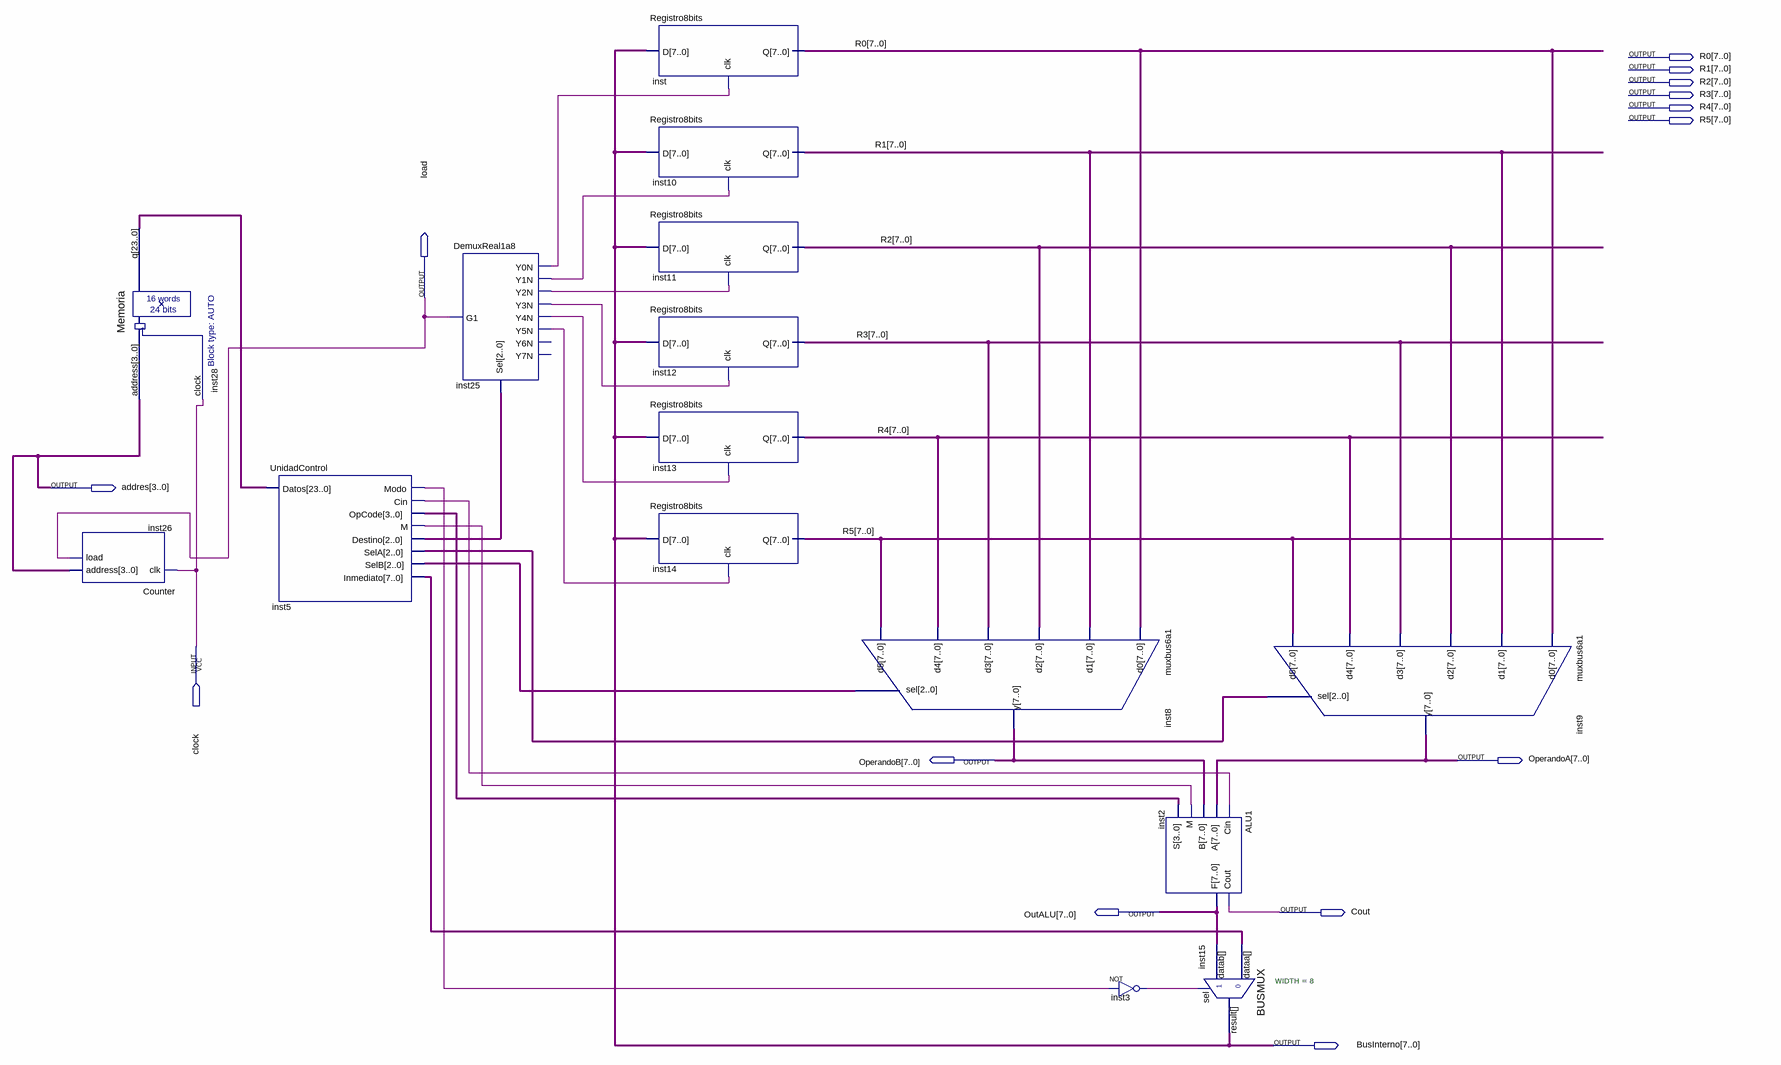
[diagram p0: schematic sheet]
// Quartus schematic CPU8bits.bdf as structural Verilog: 15 symbols, 14 pins
module CPU8bits (
  input  clock,
  output [7:0] R0,
  output [7:0] R1,
  output [7:0] R2,
  output [7:0] R3,
  output [7:0] R4,
  output [7:0] R5,
  output load,
  output [3:0] addres,
  output [7:0] OperandoB,
  output [7:0] OperandoA,
  output [7:0] OutALU,
  output Cout,
  output [7:0] BusInterno
);

  wire inst3_out, inst5_cin, inst5_m, inst5_modo, inst25_y0n, inst25_y1n, inst25_y2n, inst25_y3n, inst25_y4n,
       inst25_y5n;
  wire [2:0] inst5_destino, inst5_sela, inst5_selb;
  wire [3:0] inst5_opcode;
  wire [7:0] inst5_inmediato;
  wire [23:0] inst28_q;

  Counter inst26 (.clk(clock), .address(addres), .load(load));
  Memoria inst28 (.address(addres), .clock(clock), .q(inst28_q));
  UnidadControl inst5 (
    .Datos(inst28_q), .Modo(inst5_modo), .Cin(inst5_cin), .OpCode(inst5_opcode), .M(inst5_m),
    .Destino(inst5_destino), .SelA(inst5_sela), .SelB(inst5_selb), .Inmediato(inst5_inmediato));
  DemuxReal1a8 inst25 (
    .G1(load), .Sel(inst5_destino), .Y0N(inst25_y0n), .Y1N(inst25_y1n), .Y2N(inst25_y2n), .Y3N(inst25_y3n),
    .Y4N(inst25_y4n), .Y5N(inst25_y5n));  // open: Y6N, Y7N
  Registro8bits inst (.D(BusInterno), .clk(inst25_y0n), .Q(R0));
  Registro8bits inst10 (.D(BusInterno), .clk(inst25_y1n), .Q(R1));
  Registro8bits inst11 (.D(BusInterno), .clk(inst25_y2n), .Q(R2));
  Registro8bits inst12 (.D(BusInterno), .clk(inst25_y3n), .Q(R3));
  Registro8bits inst13 (.D(BusInterno), .clk(inst25_y4n), .Q(R4));
  Registro8bits inst14 (.D(BusInterno), .clk(inst25_y5n), .Q(R5));
  muxbus6a1 inst8 (.sel(inst5_selb), .d0(R0), .d1(R1), .d2(R2), .d3(R3), .d4(R4), .d5(R5), .y(OperandoB));
  not inst3 (inst3_out, inst5_modo);
  ALU1 inst2 (.Cin(inst5_cin), .A(OperandoA), .B(OperandoB), .M(inst5_m), .S(inst5_opcode), .Cout(Cout), .F(OutALU));
  BUSMUX #(.WIDTH(8)) inst15 (.datab(OutALU), .sel(inst3_out), .dataa(inst5_inmediato), .result(BusInterno));
  muxbus6a1 inst9 (.sel(inst5_sela), .d0(R0), .d1(R1), .d2(R2), .d3(R3), .d4(R4), .d5(R5), .y(OperandoA));
endmodule
